# EAGLE schematic KE3IJ-SuperRegen-FM-receiver (EAGLE 5.07)
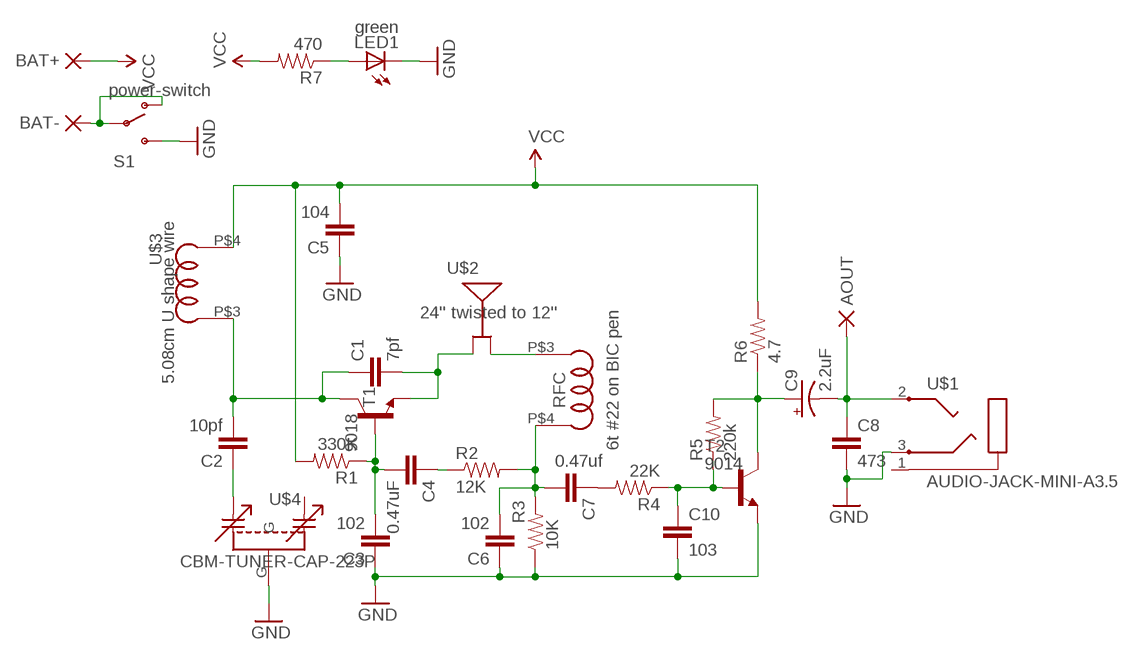
[diagram p0: schematic, sheet 1]

## Parts
AOUT  PAD-SMD20S  [SMD20S]
BAT+  PAD-SMD20S  [SMD20S]
BAT-  PAD-SMD20S  [SMD20S]
C1  7pf  CAP-CERAMIC_SMD  [CAP-SMD-SMALL]
C2  10pf  CAP-CERAMIC_SMD  [CAP-SMD-SMALL]
C3  102  CAPPTH  [CAP-PTH-SMALL]
C4  0.47uF  CAP0805  [0805]
C5  104  CAPPTH  [CAP-PTH-SMALL]
C6  102  CAPPTH  [CAP-PTH-SMALL]
C7  0.47uf  CAP0805  [0805]
C8  473  CAP0805  [0805]
C9  2.2uF  CAP_POL-SMD  [CPOL-SMD-10UF-25V]
C10  103  CAPPTH  [CAP-PTH-SMALL]
LED1  green  LED3MM  [LED3MM]
R1  330K  RESISTOR1/4W-SMD  [AXIAL-0.3-SMD]
R2  12K  RESISTOR0805  [0805]
R3  10K  RESISTOR1/4W  [AXIAL-0.3]
R4  22K  RESISTOR0805  [0805]
R5  220k  RESISTOR1/4W-SMD  [AXIAL-0.3-SMD]
R6  4.7  RESISTOR1/4W-SMD  [AXIAL-0.3-SMD]
R7  470  RESISTOR1/4W-SMD  [AXIAL-0.3-SMD]
RFC  6t #22 on BIC pen  AIR_COIL-HELICAL  [2CM-HELICAL]
S1  power-switch  SWITCH-SPST3AM6  [SWITCH-SPDT-AM#6]
T1  9018  -NPN-TO92-EBC-SMD-MIRROR  [TO92-EBC-SMD-MIRROR]
T2  9014  -NPN-TO92-EBC-SMD-MIRROR  [TO92-EBC-SMD-MIRROR]
U$1  AUDIO-JACK-MINI-A3.5  [MIN-AUDIO-3.5MM]
U$2  24'' twisted to 12''  ANT-TWIST  [ANT-WISP-2PAD]
U$3  5.08cm U shape wire  AIR_COIL-U  [2.54CM-U-COIL]
U$4  CBM-TUNER-CAP-223P  [CBM-CAP]

## Nets
GND: C3.1 C5.1 C6.1 C8.2 C10.2 LED1.K(C) R3.P$1 S1.3(S) T2.E U$1.3(RING) U$4.G
N$1: C1.P$1 C2.P$2 T1.C U$3.P$3
N$2: C10.1 R4.1 R5.P$1 T2.B
N$3: C1.P$2 T1.E U$2.P$3(S2)
N$4: C3.2 C4.2 R1.P$1 T1.B
N$5: C4.1 R2.1
N$6: C6.2 C7.2 R2.2 R3.P$2 RFC.P$4
N$7: C7.1 R4.2
N$8: AOUT.PAD(P) C8.1 C9.- U$1.2(TIP)
N$9: C9.+ R5.P$2 R6.P$1 T2.C
N$10: RFC.P$3 U$2.P$4(S1)
N$11: C2.P$1 U$4.O
N$12: BAT-.PAD(P) S1.1(O) S1.2(P)
N$13: LED1.A R7.P$1
VCC: BAT+.PAD(P) C5.2 R1.P$2 R6.P$2 R7.P$2 U$3.P$4
Unconnected: U$1.1(EARTH) U$4.A

## Library data of the parts
AOUT BAT+ BAT- = dpads:PAD: WIRE PAD Standard US Drill Sizes and SMD pads
C1-C3 C6 = digital-toy:CAP: Capacitor Standard 0603 ceramic capacitor, and 0.1" leaded capacitor.
C4 C5 C7 C8 C10 = SparkFun:CAP: Capacitor Standard 0603 ceramic capacitor, and 0.1" leaded capacitor.
C9 = digital-toy:CAP_POL: Capacitor Polarized These are standard SMD and PTH capacitors. Normally 10uF, 47uF, and 100uF in electrolytic and tantalum varieties. Always verify the external diameter of the through hole cap, it varies with capacity, voltage, and manufacturer. The EIA devices should be standard.
LED1 = digital-toy:LED: LEDs Standard schematic elements and footprints for 5mm, 3mm, 1206, and 0603 sized LEDs. 5mm - Spark Fun Electronics SKU : COM-00529 (and others) copy led.lbr 0805 led here, by hyl digital-toy. 2010.6.29
R1-R7 = digital-toy:RESISTOR: Resistor Basic schematic elements and footprints for 0603, 1206, and PTH 1/10th watt (small) resistors. digital-toy copy vertical mount of axial-0.3 from rcl.lbr : the 0207/xx
RFC U$3 = digital-toy:AIR_COIL
S1 = digital-toy:SWITCH-SPST: SPST Switch Simple slide switch. Spark Fun Electronics SKU : COM-00102
T1 T2 = digital-toy:*-NPN-: NPN Transistror most of sot-23 use the pacages sot23-BEC, top C, left B, right E. by hyl, digital-toy. and to-92 use ebc(from-top) by hyl, digital-toy.
U$1 = digital-toy:AUDIO-JACK: 2.5 Stereo Audio Jack (SMT)
U$2 = digital-toy:ANT-TWIST
U$4 = digital-toy:CBM-TUNER-CAP